# EAGLE design combo-03 (EAGLE 7.7.0)
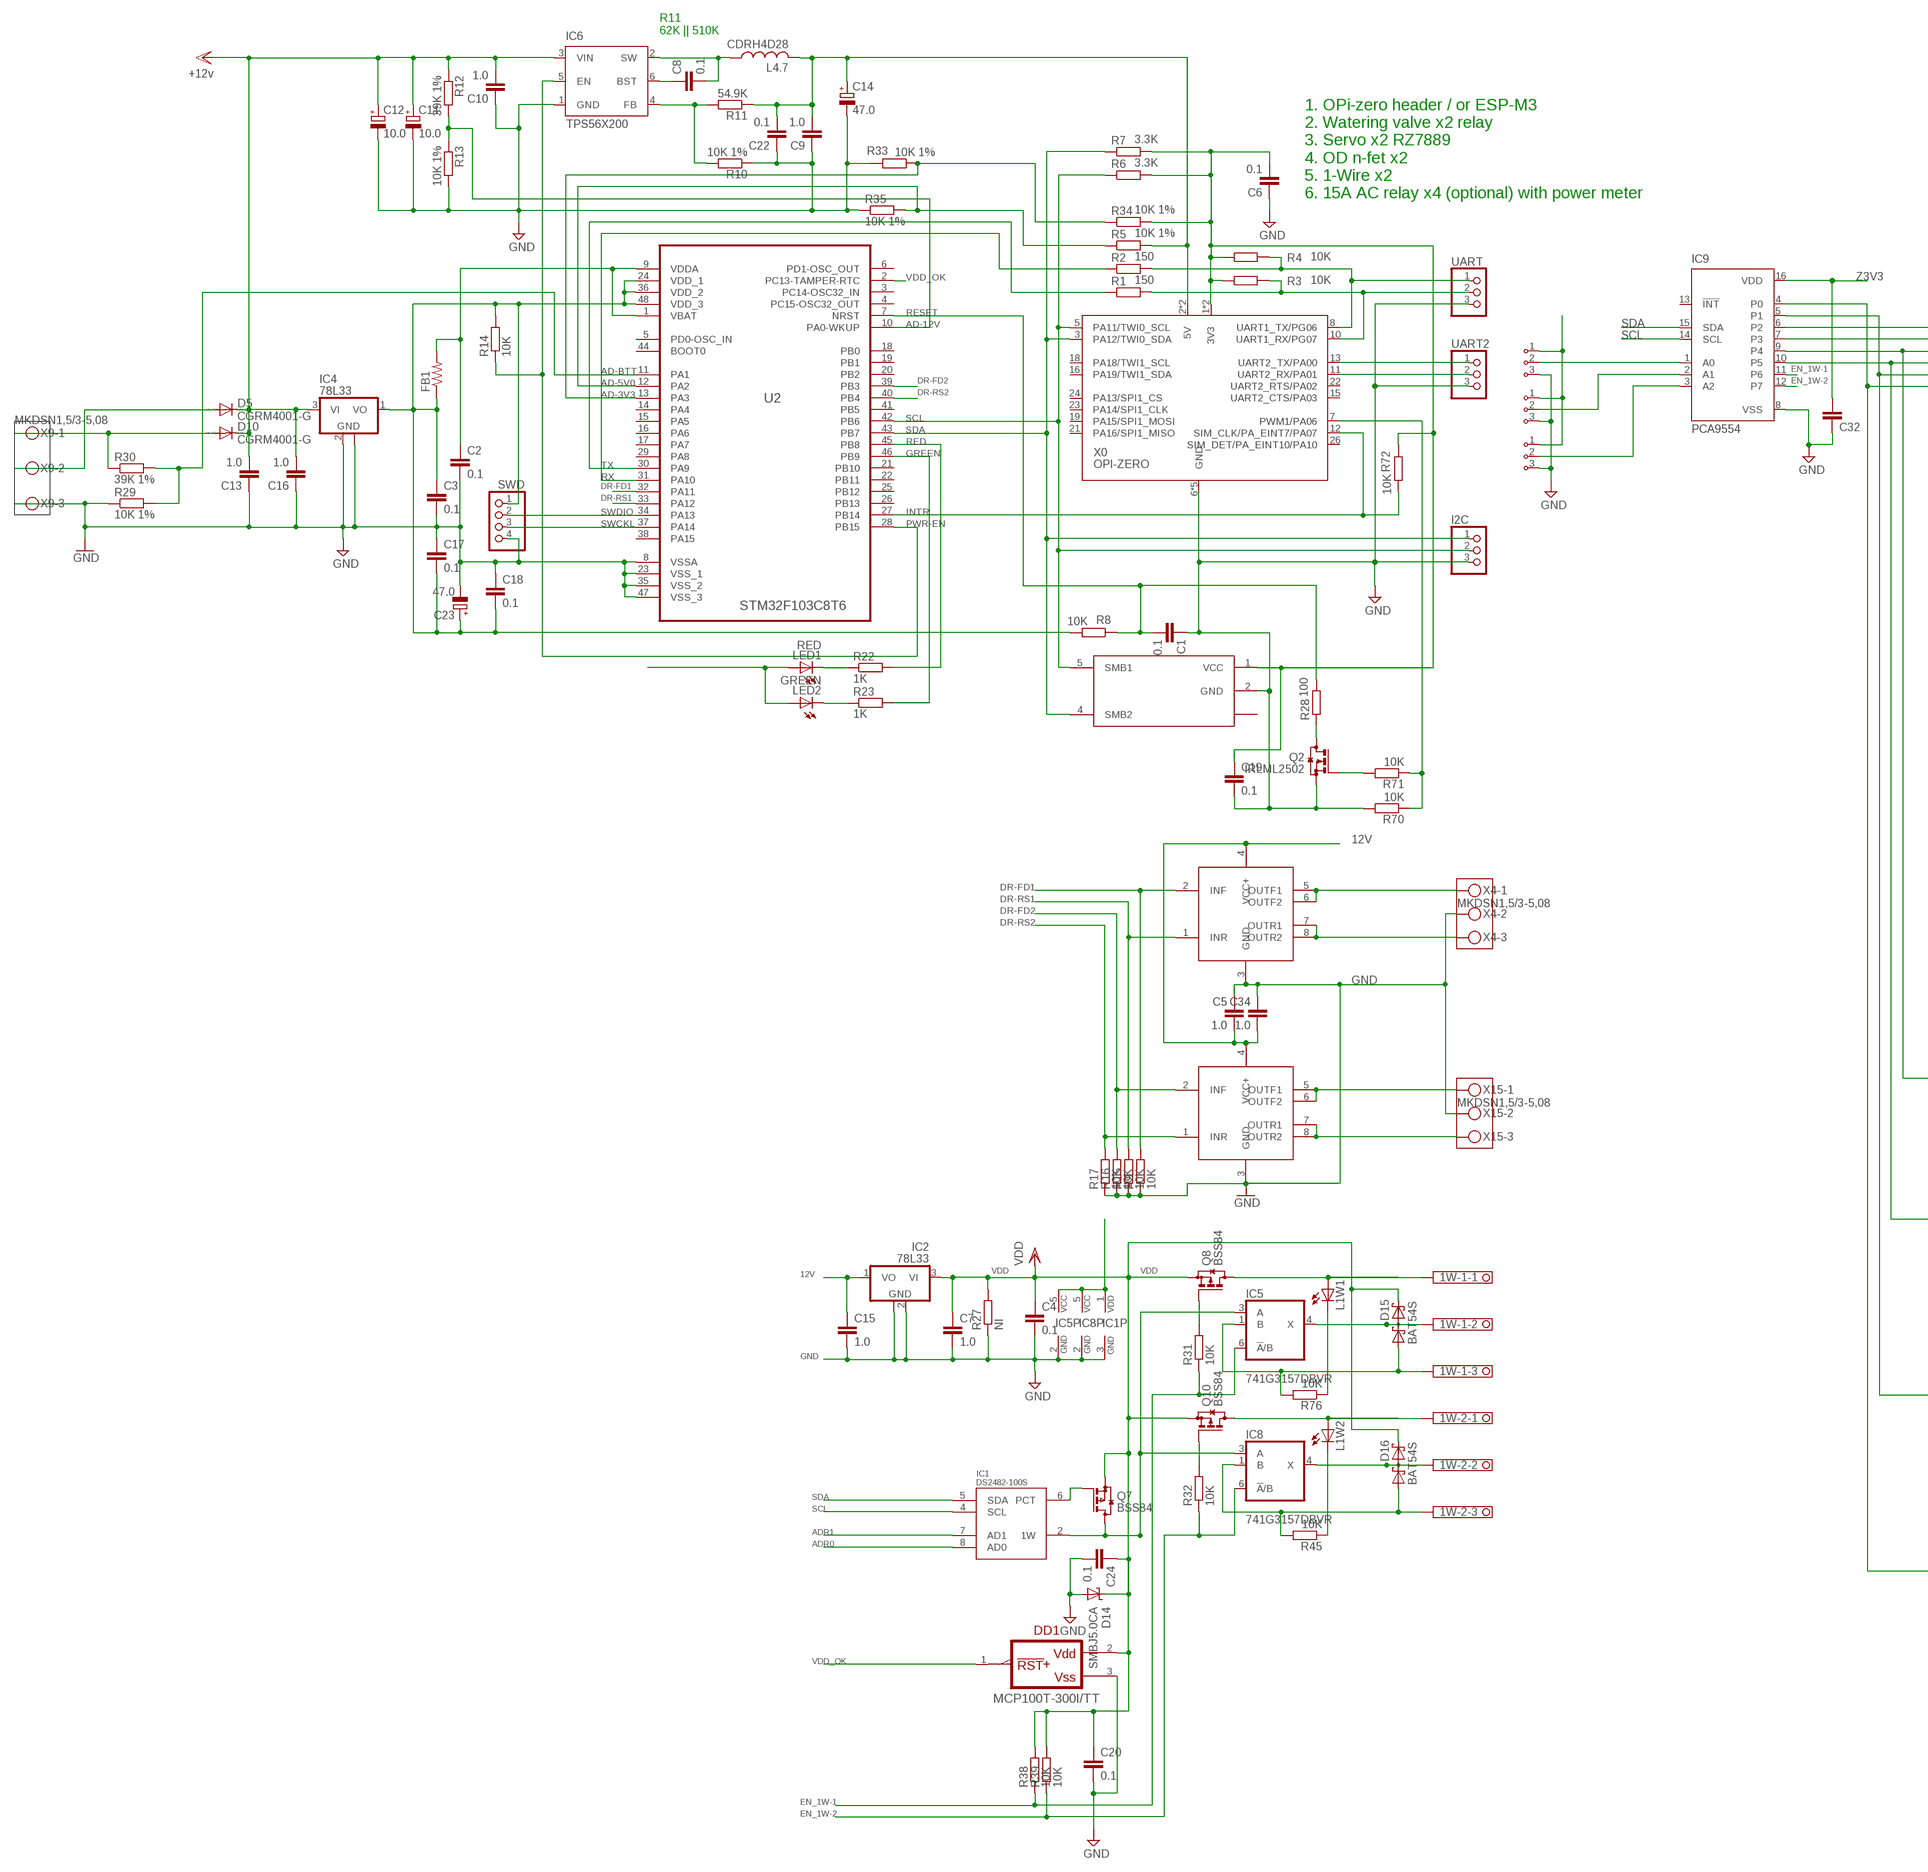
[diagram p0: schematic, sheet 1, part 1 of 2]
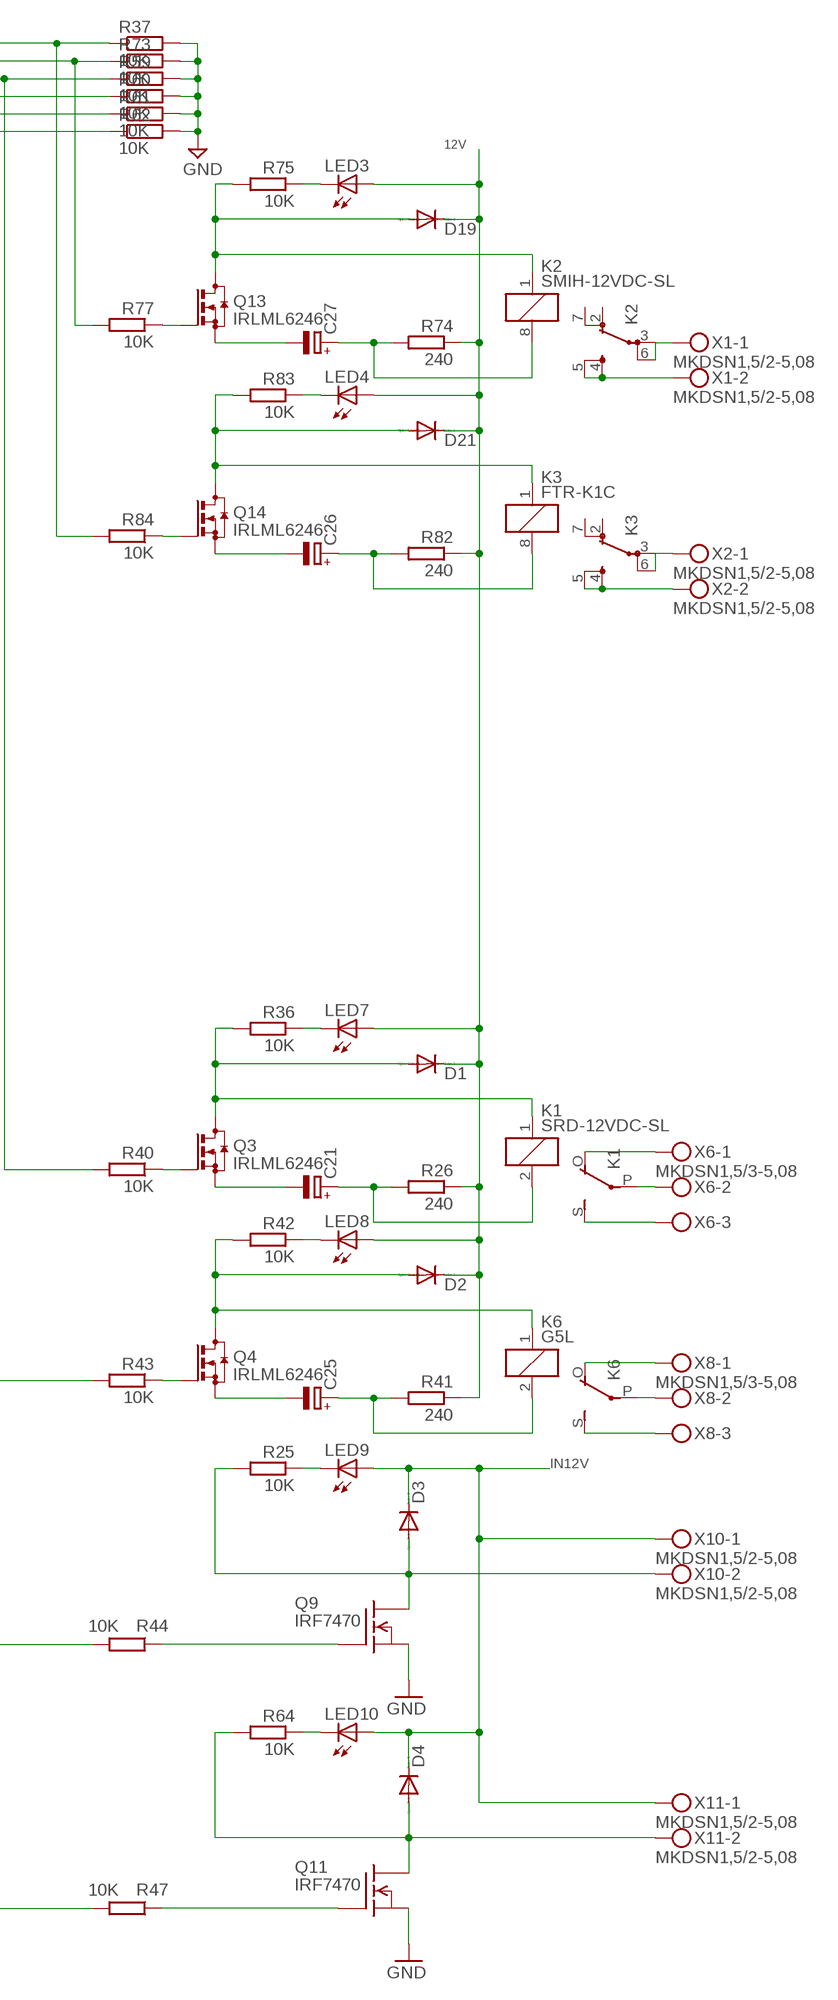
[diagram p1: schematic, sheet 1, part 2 of 2]

## Parts
1W-1  1751251  [1751251]
1W-2  1751251  [1751251]
A0  ADDR3PIN0603  [0603-3PIN]
A1  ADDR3PIN0603  [0603-3PIN]
A2  ADDR3PIN0603  [0603-3PIN]
C1  0.1  C-EUC0603  [C0603]
C2  0.1  C-EUC0603  [C0603]
C3  0.1  C-EUC0603  [C0603]
C4  0.1  C-EUC0603  [C0603]
C5  1.0  C-EUC0805  [C0805]
C6  0.1  C-EUC0805  [C0805]
C7  1.0  C-EUC0805  [C0805]
C8  0.1  C-EUC0805  [C0805]
C9  1.0  C-EUC0805  [C0805]
C10  1.0  C-EUC1206  [C1206]
C11  10.0  CPOL-EUC/6032-28R  [C/6032-28R]
C12  10.0  CPOL-EUC/6032-28R  [C/6032-28R]
C13  1.0  C-EUC1206  [C1206]
C14  47.0  CPOL-EUB/3528-21R  [B/3528-21R]
C15  1.0  C-EUC0805  [C0805]
C16  1.0  C-EUC1206  [C1206]
C17  0.1  C-EUC0603  [C0603]
C18  0.1  C-EUC0603  [C0603]
C19  0.1  C-EUC0603  [C0603]
C20  0.1  C-EUC0603  [C0603]
C21  CPOL-EUE3.5-8  [E3,5-8]
C22  0.1  C-EUC0805  [C0805]
C23  47.0  CPOL-EUB/3528-21R  [B/3528-21R]
C24  0.1  C-EUC0603  [C0603]
C25  CPOL-EUE3.5-8  [E3,5-8]
C26  CPOL-EUE3.5-8  [E3,5-8]
C27  CPOL-EUE3.5-8  [E3,5-8]
C32  C-EUC0805  [C0805]
C34  1.0  C-EUC0805  [C0805]
D1  DIODE-SOD123  [SOD123]
D2  DIODE-SOD123  [SOD123]
D3  DIODE-SOD123  [SOD123]
D4  DIODE-SOD123  [SOD123]
D5  CGRM4001-G  [SOD-123_MINI-SMA]
D10  CGRM4001-G  [SOD-123_MINI-SMA]
D14  SMBJ5.0CA  SUPPRESSOR-SMBJ  [SMBJ]
D15  BAT54S  [SOT23]
D16  BAT54S  [SOT23]
D19  DIODE-SOD123  [SOD123]
D21  DIODE-SOD123  [SOD123]
DD1  MCP100T-300I/TT  [SOT23]
FB1  R-US_R0805  [R0805]
I2C  PINHD-1X3  [1X03]
IC1  DS2482-100S  [SO08]
IC2  78L33  78L05F  [SOT89]
IC3  RZ7889  [SO8]
IC4  78L33  78L05F  [SOT89]
IC5  741G3157DBVR  [DBV_R-PDSO-G6]
IC6  TPS56X200  [TSOT23-6_DDC]
IC7  LTC1694  [SOT23-5]
IC8  741G3157DBVR  [DBV_R-PDSO-G6]
IC9  PCA9554  PCF8574T  [SO16W]
IC10  RZ7889  [SO8]
K1  SRD-12VDC-SL  G5L  [G5LE]
K2  SMIH-12VDC-SL  FTR-K1C  [FTR-K1C]
K3  FTR-K1C  [FTR-K1C]
K6  G5L  [G5LE]
L1W1  LEDSMT1206  [1206]
L1W2  LEDSMT1206  [1206]
L4.7  CDRH4D28  [CDRH4D28]
LED1  RED  LEDCHIPLED_1206  [CHIPLED_1206]
LED2  GREEN  LEDCHIPLED_1206  [CHIPLED_1206]
LED3  LEDSMT1206  [1206]
LED4  LEDSMT1206  [1206]
LED7  LEDSMT1206  [1206]
LED8  LEDSMT1206  [1206]
LED9  LEDSMT1206  [1206]
LED10  LEDSMT1206  [1206]
Q2  IRLML2502  [SOT23]
Q3  IRLML6246  BSS123  [SOT23]
Q4  IRLML6246  BSS123  [SOT23]
Q7  BSS84  [SOT23]
Q8  BSS84  [SOT23]
Q9  IRF7470  FDS5680  [SO-8]
Q10  BSS84  [SOT23]
Q11  IRF7470  FDS5680  [SO-8]
Q13  IRLML6246  BSS123  [SOT23]
Q14  IRLML6246  BSS123  [SOT23]
R1  150  R-EU_R0603  [R0603]
R2  150  R-EU_R0603  [R0603]
R3  10K  R-EU_R0603  [R0603]
R4  10K  R-EU_R0603  [R0603]
R5  10K 1%  R-EU_R0603  [R0603]
R6  3.3K  R-EU_R0603  [R0603]
R7  3.3K  R-EU_R0603  [R0603]
R8  10K  R-EU_R0603  [R0603]
R9  10K  R-EU_R0603  [R0603]
R10  10K 1%  R-EU_R0603  [R0603]
R11  54.9K  R-EU_R0603  [R0603]
R12  39K 1%  R-EU_R0603  [R0603]
R13  10K 1%  R-EU_R0603  [R0603]
R14  10K  R-EU_R0603  [R0603]
R15  10K  R-EU_R0603  [R0603]
R16  10K  R-EU_R0603  [R0603]
R17  10K  R-EU_R0603  [R0603]
R22  1K  R-EU_R0603  [R0603]
R23  1K  R-EU_R0603  [R0603]
R25  10K  R-EU_R0603  [R0603]
R26  240  R-EU_R1206  [R1206]
R27  NI  R-EU_R0603  [R0603]
R28  100  R-EU_R0603  [R0603]
R29  10K 1%  R-EU_R0603  [R0603]
R30  39K 1%  R-EU_R0603  [R0603]
R31  10K  R-EU_R0603  [R0603]
R32  10K  R-EU_R0603  [R0603]
R33  10K 1%  R-EU_R0603  [R0603]
R34  10K 1%  R-EU_R0603  [R0603]
R35  10K 1%  R-EU_R0603  [R0603]
R36  10K  R-EU_R0603  [R0603]
R37  10K  R-EU_R0603  [R0603]
R38  10K  R-EU_R0603  [R0603]
R39  10K  R-EU_R0603  [R0603]
R40  10K  R-EU_R0603  [R0603]
R41  240  R-EU_R1206  [R1206]
R42  10K  R-EU_R0603  [R0603]
R43  10K  R-EU_R0603  [R0603]
R44  10K  R-EU_R0603  [R0603]
R45  10K  R-EU_R0603  [R0603]
R47  10K  R-EU_R0603  [R0603]
R59  10K  R-EU_R0603  [R0603]
R60  10K  R-EU_R0603  [R0603]
R61  10K  R-EU_R0603  [R0603]
R62  10K  R-EU_R0603  [R0603]
R64  10K  R-EU_R0603  [R0603]
R70  10K  R-EU_R0603  [R0603]
R71  10K  R-EU_R0603  [R0603]
R72  10K  R-EU_R0603  [R0603]
R73  10K  R-EU_R0603  [R0603]
R74  240  R-EU_R1206  [R1206]
R75  10K  R-EU_R0603  [R0603]
R76  10K  R-EU_R0603  [R0603]
R77  10K  R-EU_R0603  [R0603]
R82  240  R-EU_R1206  [R1206]
R83  10K  R-EU_R0603  [R0603]
R84  10K  R-EU_R0603  [R0603]
SWD  PINHD-1X4  [1X04]
U2  STM32F103C8T6  STM32F100CBT6B  [QFP50P900X900X160-48N]
UART  PINHD-1X3  [1X03]
UART2  PINHD-1X3  [1X03]
X0  OPI-ZERO  [OPI0]
X1  MKDSN1,5/2-5,08  [MKDSN1,5/2-5,08]
X2  MKDSN1,5/2-5,08  [MKDSN1,5/2-5,08]
X4  MKDSN1,5/3-5,08  [MKDSN1,5/3-5,08]
X6  MKDSN1,5/3-5,08  [MKDSN1,5/3-5,08]
X8  MKDSN1,5/3-5,08  [MKDSN1,5/3-5,08]
X9  MKDSN1,5/3-5,08  [MKDSN1,5/3-5,08]
X10  MKDSN1,5/2-5,08  [MKDSN1,5/2-5,08]
X11  MKDSN1,5/2-5,08  [MKDSN1,5/2-5,08]
X15  MKDSN1,5/3-5,08  [MKDSN1,5/3-5,08]

## Nets
1W: IC1.2(1W) IC5.3(A) IC8.3(A) Q7.3(D)
1W1-VDD: 1W-1.1 L1W1.A Q8.3(D)
1W2-VDD: 1W-2.1 L1W2.A Q10.3(D)
12V [POWER]: C5.2 C10.2 C11.+ C12.+ C13.2 C15.1 C16.2 C34.2 D1.C D2.C D5.C D10.C D19.C D21.C IC2.1(VO) IC3.4(VCC+) IC4.3(VI) IC6.3(VIN) IC10.4(VCC+) LED3.A LED4.A LED7.A LED8.A R12.1 R26.1 R41.1 R74.1 R82.1 ; supply symbol labelled +12v
+3V3 [POWER]: C3.1 C17.2 C18.2 C23.+ FB1.1 IC4.1(VO) R8.2 R14.2 SWD.1 U2.24(VDD_1) U2.36(VDD_2) U2.48(VDD_3)
AD-3V3: R33.1 R34.1 U2.13(PA3)
AD-5V0: R5.1 R35.2 U2.12(PA2)
AD-12V: R12.2 R13.1 U2.10(PA0-WKUP)
AD-BTT: R29.2 R30.2 U2.11(PA1)
ADR0: A2.2 IC1.8(AD0) IC9.1(A0)
ADR1: A1.2 IC1.7(AD1) IC9.2(A1)
ADR2: A0.2 IC9.3(A2)
BAT+: D10.A R30.1 X9.1
DR-FD1: IC3.2(INF) R9.2 U2.32(PA11)
DR-FD2: IC10.2(INF) R16.2 U2.39(PB3)
DR-RS1: IC3.1(INR) R15.2 U2.33(PA12)
DR-RS2: IC10.1(INR) R17.2 U2.40(PB4)
EN_1W-1: IC5.6(!A!/B) IC9.11(P6) R31.1 R38.1
EN_1W-2: IC8.6(!A!/B) IC9.12(P7) R32.1 R39.1
FET: D3.A Q9.5(D) Q9.6(D) Q9.7(D) Q9.8(D) R25.2 X10.2
FET1: D4.A Q11.5(D) Q11.6(D) Q11.7(D) Q11.8(D) R64.2 X11.2
FR1: IC3.5(OUTF1) IC3.6(OUTF2) X4.1
FR2: IC10.5(OUTF1) IC10.6(OUTF2) X15.1
GND [POWER]: 1W-1.3 1W-2.3 A0.3 A1.3 A2.3 C1.1 C2.2 C3.2 C4.2 C5.1 C6.1 C7.2 C9.1 C10.1 C11.- C12.- C13.1 C14.- C15.2 C16.1 C17.1 C18.1 C19.2 C20.2 C21.- C22.1 C23.- C24.2 C25.- C26.- C27.- C32.1 C34.1 D14.A D15.1(A1) D16.1(A1) DD1.3(VSS) I2C.3 IC1.3(GND) IC2.2(GND) IC2.2@1(GND) IC3.3(GND) IC4.2(GND) IC4.2@1(GND) IC5.1(B) IC5.2(GND) IC6.1(GND) IC7.2(GND) IC8.1(B) IC8.2(GND) IC9.8(VSS) IC10.3(GND) Q2.2(S) Q3.2(S) Q4.2(S) Q9.1(S) Q9.2(S) Q9.3(S) Q11.1(S) Q11.2(S) Q11.3(S) Q13.2(S) Q14.2(S) R9.1 R10.1 R13.2 R15.1 R16.1 R17.1 R27.1 R29.1 R33.2 R35.1 R37.2 R45.2 R59.2 R60.2 R61.2 R62.2 R70.2 R73.2 R76.2 SWD.4 U2.8(VSSA) U2.23(VSS_1) U2.35(VSS_2) U2.47(VSS_3) UART2.3 UART.3 X0.6(GND) X0.9(GND) X0.14(GND) X0.20(GND) X0.25(GND) X4.2 X9.3 X15.2
GPIO1: IC9.9(P4) R40.2 R59.1
GPIO2: IC9.10(P5) R43.2 R60.1
GPIO4: IC9.7(P3) R73.1 R77.2
GREEN: R23.2 U2.46(PB9)
IN12V [POWER]: D3.C D4.C D5.A LED9.A LED10.A X9.2 X10.1 X11.1
INTR: R72.2 U2.27(PB14) X0.12(SIM_CLK/PA_EINT7/PA07)
IO13: IC9.5(P1) R44.2 R61.1
N$2: K3.4(-1:SA) K3.5(-1:SB) X2.2
N$3 [POWER]: C8.2 IC6.2(SW) L4.7.P$1
N$4: Q2.3(D) R28.1
N$5: Q2.1(G) R71.2
N$9: IC9.6(P2) R37.1 R84.2
N$10: Q9.4(G) R44.1
N$11: IC1.6(PCT) Q7.1(G)
N$13: Q14.1(G) R84.1
N$15: D1.A K1.1 Q3.3(D) R36.2
N$16: C21.+ K1.2 R26.2
N$17: C8.1 IC6.6(BST)
N$18: LED7.C R36.1
N$19: Q3.1(G) R40.1
N$20: D2.A K6.1 Q4.3(D) R42.2
N$21: C25.+ K6.2 R41.2
N$22: IC6.4(FB) R10.2 R11.2
N$23: LED8.C R42.1
N$24: Q4.1(G) R43.1
N$27: 1W-1.2 D15.3(C1A2) IC5.4(X)
N$37: Q8.1(G) R31.2
N$39: IC9.4(P0) R47.2 R62.1
N$40: K3.3(-1:PA) K3.6(-1:PB) X2.1
N$41: 1W-2.2 D16.3(C1A2) IC8.4(X)
N$45: Q10.1(G) R32.2
N$47: K1.P(2:P) X6.2
N$51: K6.P(2:P) X8.2
N$55: D19.A K2.1 Q13.3(D) R75.2
N$60: C27.+ K2.8 R74.2
N$62: LED3.C R75.1
N$69: Q11.4(G) R47.1
N$70: LED10.C R64.1
N$71: LED9.C R25.1
N$75: LED1.C R22.1
N$111: D21.A K3.1 Q14.3(D) R83.2
N$112: Q13.1(G) R77.1
N$115: L1W2.C R45.1
N$116: L1W1.C R76.1
N$117: C26.+ K3.8 R82.2
N$118: LED4.C R83.1
N$119: LED2.C R23.1
N$128: K2.3(-1:PA) K2.6(-1:PB) X1.1
N$129: K2.4(-1:SA) K2.5(-1:SB) X1.2
NC1: K1.O(2:O) X6.1
NC6: K6.O(2:O) X8.1
NO1: K1.S(2:S) X6.3
NO6: K6.S(2:S) X8.3
PA06: R70.1 R71.1 X0.7(PWM1/PA06)
PWR-EN: IC6.5(EN) R14.1 U2.28(PB15)
RED: R22.2 U2.45(PB8)
RESET: C1.2 R8.1 R28.2 U2.7(NRST)
RS1: IC3.7(OUTR1) IC3.8(OUTR2) X4.3
RS2: IC10.7(OUTR1) IC10.8(OUTR2) X15.3
RX: R2.1 U2.31(PA10)
SCL: I2C.2 IC1.4(SCL) IC7.5(SMB1) IC9.14(SCL) R6.1 U2.42(PB6) X0.5(PA11/TWI0_SCL)
SDA: I2C.1 IC1.5(SDA) IC7.4(SMB2) IC9.15(SDA) R7.1 U2.43(PB7) X0.3(PA12/TWI0_SDA)
SWCKL: SWD.3 U2.37(PA14)
SWDIO: SWD.2 U2.34(PA13)
TX: R1.1 U2.30(PA9)
VDD [POWER]: C4.1 C7.1 C20.1 C24.1 D14.C D15.2(C2) D16.2(C2) DD1.2(VDD) IC2.3(VI) LED1.A LED2.A Q7.2(S) Q8.2(S) Q10.2(S) R27.2 R38.2 R39.2
VDD_OK: DD1.1(!RST) U2.2(PC13-TAMPER-RTC)
VDDA: C2.1 FB1.2 U2.1(VBAT) U2.9(VDDA)
Z2RX: UART2.2 X0.11(UART2_RX/PA01)
Z2TX: UART2.1 X0.13(UART2_TX/PA00)
Z3V3 [POWER]: A0.1 A1.1 A2.1 C6.2 C19.1 C32.2 IC1.1(VDD) IC5.5(VCC) IC7.1(VCC) IC8.5(VCC) IC9.16(VDD) R3.1 R4.1 R6.2 R7.2 R34.2 R72.1 X0.1(3V3) X0.17(3V3)
Z5V [POWER]: C9.2 C14.+ C22.2 L4.7.P$2 R5.2 R11.1 X0.2(5V) X0.4(5V)
ZRX: R1.2 R3.2 UART.2 X0.10(UART1_RX/PG07)
ZTX: R2.2 R4.2 UART.1 X0.8(UART1_TX/PG06)
Unconnected: IC7.3(NC) IC9.13(!INT) K2.2(-1:OA) K2.7(-1:OB) K3.2(-1:OA) K3.7(-1:OB) U2.3(PC14-OSC32_IN) U2.4(PC15-OSC32_OUT) U2.5(PD0-OSC_IN) U2.6(PD1-OSC_OUT) U2.14(PA4) U2.15(PA5) U2.16(PA6) U2.17(PA7) U2.18(PB0) U2.19(PB1) U2.20(PB2) U2.21(PB10) U2.22(PB11) U2.25(PB12) U2.26(PB13) U2.29(PA8) U2.38(PA15) U2.41(PB5) U2.44(BOOT0) X0.15(UART2_CTS/PA03) X0.16(PA19/TWI1_SDA) X0.18(PA18/TWI1_SCL) X0.19(PA15/SPI1_MOSI) X0.21(PA16/SPI1_MISO) X0.22(UART2_RTS/PA02) X0.23(PA14/SPI1_CLK) X0.24(PA13/SPI1_CS) X0.26(SIM_DET/PA_EINT10/PA10)

## Notes on the sheet
- R11
  62K || 510K
- 1. OPi-zero header / or ESP-M3 
  2. Watering valve x2 relay
  3. Servo x2 RZ7889
  4. OD n-fet x2
  5. 1-Wire x2
  6. 15A AC relay x4 (optional) with power meter

## Library data of the parts
1W-1 1W-2 = con-phoenix-350:1751251: MKDS 1/ 3-3,5 Printklemme Nennstrom: 10 A Bemessungsspannung: 160 V Raster: 3,5 mm Polzahl: 3 Montageart: Löten Anschlussart: Schraubanschluss Anschlussrichtung vom Leiter zur Platine: 0° Source: http://eshop.phoenixcontact.com .. 1751251.pdf; OC_FARNELL: unknown; OC_NEWARK: unknown
A0 A1 A2 = components:ADDR3PIN
C1-C10 C13 C15-C20 C22 C24 C32 C34 = rcl:C-EU: CAPACITOR, European symbol
C11 C12 C14 C21 C23 C25-C27 = rcl:CPOL-EU: POLARIZED CAPACITOR, European symbol
D1-D4 D19 D21 = diode:DIODE-: DIODE
D5 D10 = diode:CGRM400*-G: Molded plasitc,JEDEC SOD-123/Mini SMA Source: Comchip CGRM4001-G.pdf
D14 = diode:SUPPRESSOR-: Suppressor diode
D15 D16 = diode:BAT54S: Schottky Diodes Pin connection corrected 2011-05-04 Source: Fairchild .. BAT54.pdf
DD1 = ic-microchip:MCP100; MOUSER: 579-MCP100T-300I/TT
FB1 = rcl:R-US_: RESISTOR, American symbol
I2C UART UART2 = pinhead:PINHD-1X3: PIN HEADER
IC1 = 1wire:DS2482-100: I2C to 1-Wire Host Adapter/Line Driver This device is a onewire host and I2C interface in one chip. It provides the complete DC/AC requirements for onewire communication, including overdrive speed mode, but, unlike the DS2480B chip, no 12V EPROM programming. Notes: For overdrive speed and 5V EEPROM programming, an external active pullup circuit must be connected to the 1W, VDD and PCT pin. See the datasheet for details. The lower two I2C adress bits of the chip can be selected by external pins, so up to 4 chips may be connected to the same I2C bus. Author: Orginal device and description from Giovanni Varasano <giovanni.varasano@fastwebnet.it> Improved by Jan Kandziora <jjj@gmx.de>
IC2 IC4 = linear:78L*: POSITOIV-VOLTAGE REGULATORS Output up to 100 mA Source: Datasheet <http://focus.ti.com/lit/ds/symlink/ua78l05.pdf>
IC3 IC10 = components:RZ788
IC5 IC8 = 74xx-little-de:74*1G3157: Single-Pole, Double-Throw Analog Switch Source: http://focus.ti.com/lit/ds/symlink/sn74lvc1g3157.pdf
IC6 = custom:TPS56X200
IC7 = components:LTC1694: Dual SMBus active pull-up
IC9 = micro-philips:PCF8574: I2C-Bus Remote 8-bit I/O expander http://www.semiconductors.philips.com/acrobat_download/datasheets/PCF8574_4.pdf; MPN: PCF8574T/3,512; OC_FARNELL: 1201255; OC_NEWARK: 70R6870
K1 K6 = relay:G5L: RELAY 1 x switch, 10 A/120 V AC, 8 A/30 V ADC, Omron; OC_FARNELL: unknown; OC_NEWARK: unknown
K2 K3 = relay:FTR-K1C: NETZRELAIS FTR-K1CK024W1XUM 16A/250VAC 1 Umschaltkontakt Distributor: Conrad Electronic Bestell Nr.: 504389-13 - 24V Source: http://www.produktinfo.conrad.com/datenblaetter/500000-524999/504384-da-01-de-NETZRELAIS_FTR_K1CK012W1XUM_16A_250VAC.pdf; OC_FARNELL: unknown; OC_NEWARK: unknown
L1W1 L1W2 LED1-LED4 LED7-LED10 = led:LED: LED OSRAM: - CHIPLED LG R971, LG N971, LY N971, LG Q971, LY Q971, LO R971, LY R971 LH N974, LH R974 LS Q976, LO Q976, LY Q976 LO Q996 - Hyper CHIPLED LW Q18S LB Q993, LB Q99A, LB R99A - SideLED LS A670, LO A670, LY A670, LG A670, LP A670 LB A673, LV A673, LT A673, LW A673 LH A674 LY A675 LS A676, LA A676, LO A676, LY A676, LW A676 LS A679, LY A679, LG A679 - Hyper Micro SIDELED® LS Y876, LA Y876, LO Y876, LY Y876 LT Y87S - SmartLED LW L88C, LW L88S LB L89C, LB L89S, LG L890 LS L89K, LO L89K, LY L89K LS L896, LA L896, LO L896, LY L896 - TOPLED LS T670, LO T670, LY T670, LG T670, LP T670 LSG T670, LSP T670, LSY T670, LOP T670, LYG T670 LG T671, LOG T671, LSG T671 LB T673, LV T673, LT T673, LW T673 LH T674 LS T676, LA T676, LO T676, LY T676, LB T676, LH T676, LSB T676, LW T676 LB T67C, LV T67C, LT T67C, LS T67K, LO T67K, LY T67K, LW E67C LS E67B, LA E67B, LO E67B, LY E67B, LB E67C, LV E67C, LT E67C LW T67C LS T679, LY T679, LG T679 LS T770, LO T770, LY T770, LG T770, LP T770 LB T773, LV T773, LT T773, LW T773 LH T774 LS E675, LA E675, LY E675, LS T675 LS T776, LA T776, LO T776, LY T776, LB T776 LHGB T686 LT T68C, LB T68C - Hyper Mini TOPLED® LB M676 - Mini TOPLED Santana® LG M470 LS M47K, LO M47K, LY M47K Source: http://www.osram.convergy.de LUXEON: - LUMILED® LXK2-PW12-R00, LXK2-PW12-S00, LXK2-PW14-U00, LXK2-PW14-V00 LXK2-PM12-R00, LXK2-PM12-S00, LXK2-PM14-U00 LXK2-PE12-Q00, LXK2-PE12-R00, LXK2-PE12-S00, LXK2-PE14-T00, LXK2-PE14-U00 LXK2-PB12-K00, LXK2-PB12-L00, LXK2-PB12-M00, LXK2-PB14-N00, LXK2-PB14-P00, LXK2-PB14-Q00 LXK2-PR12-L00, LXK2-PR12-M00, LXK2-PR14-Q00, LXK2-PR14-R00 LXK2-PD12-Q00, LXK2-PD12-R00, LXK2-PD12-S00 LXK2-PH12-R00, LXK2-PH12-S00 LXK2-PL12-P00, LXK2-PL12-Q00, LXK2-PL12-R00 Source: www.luxeon.com KINGBRIGHT: KA-3528ASYC Source: www.kingbright.com
L4.7 = custom:CDRH4D28
Q2 = components:IRLML2502: N-CHANNEL MOS FET
Q3 Q4 Q13 Q14 = transistor-small-signal:BSS123: N-CHANNEL MOS FET
Q7 Q8 Q10 = transistor-small-signal:BSS84: P-CHANNEL MOS FET
Q9 Q11 = transistor-fet:FDS5680: 60V N-Channel PowerTrench TM MOSFET FAIRCHILD FDS5680.pdf
R1-R17 R22 R23 R25-R45 R47 R59-R62 R64 R70-R77 R82-R84 = rcl:R-EU_: RESISTOR, European symbol
SWD = pinhead:PINHD-1X4: PIN HEADER
U2 = ST Microelctronics_By_element14_Batch_1:STM32F100CBT6B: ARM-based 32-bit MCU; MPN: STM32F100CBT6B; OC_FARNELL: 1838512; OC_NEWARK: 86R1308; PACKAGE: LQFP-48; SUPPLIER: STMircroelectronics
X0 = OrangePi0:OPI-ZERO: Orange Pi Zero Footprint. Only 2x13 pin header. -- UNTESTED!
X1 X2 X10 X11 = con-phoenix-508:MKDSN1,5/2-5,08: MKDSN 1,5/ 2-5,08 Printklemme Nennstrom: 13,5 A Nennspannung: 250 V Rastermaß: 5,08 mm Polzahl: 2 Anschlussart: Schraubanschluss Montage: Löten Anschlussrichtung Leiter/Platine: 0 ° Artikelnummer: 1729128 Source: http://eshop.phoenixcontact.com .. 1729128.pdf
X4 X6 X8 X9 X15 = con-phoenix-508:MKDSN1,5/3-5,08: MKDSN 1,5/ 3-5,08 Printklemme Nennstrom: 13,5 A Nennspannung: 250 V Rastermaß: 5,08 mm Polzahl: 3 Anschlussart: Schraubanschluss Montage: Löten Anschlussrichtung Leiter/Platine: 0 ° Artikelnummer: 1729131 Source: http://eshop.phoenixcontact.com .. 1729131.pdf

## Net classes
0 default: width 0.254 mm, clearance 0.254 mm
1 POWER: width 0.508 mm, clearance 0.254 mm
2 HV: width 1.27 mm, clearance 1.27 mm

## Board
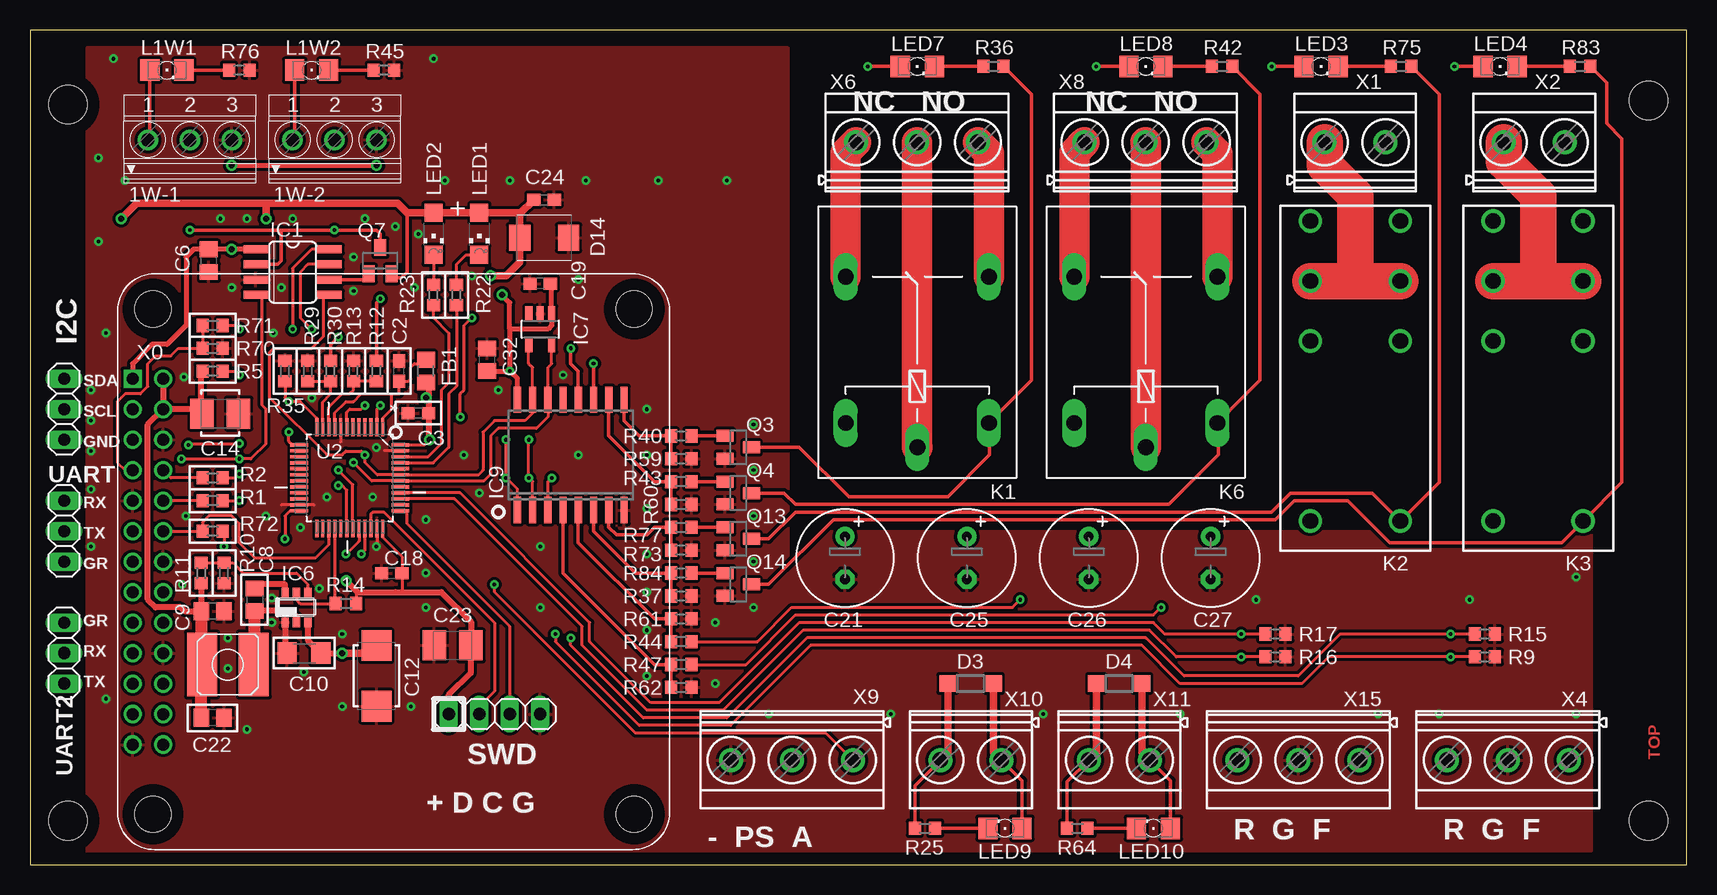
[diagram p2: board, top side]
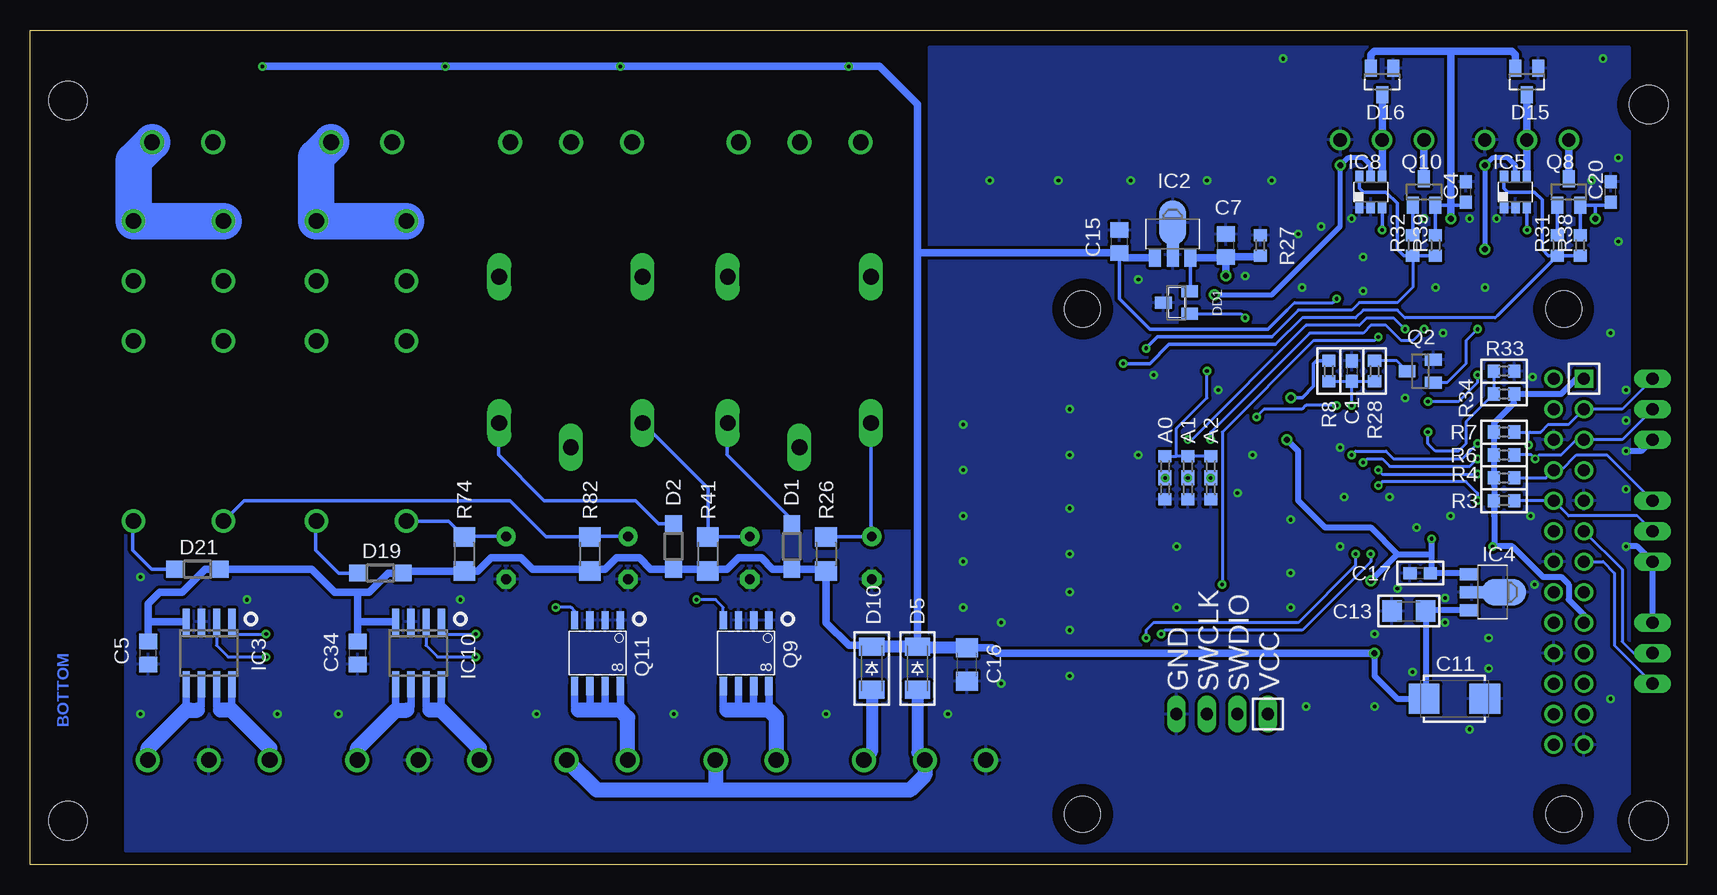
[diagram p3: board, bottom side, seen from below]

Size 138.1 x 69.58 mm. Coordinates in mm from the lower left corner, seen from the top.
Outline: 138.1,0 138.1,69.58 0,69.58 0,0 138.1,0
Copper layers (1*16): Top 0.035mm / dielectric 1.5mm / Bottom 0.035mm
Design rules "default *": minimum track width 8mil, minimum drill 0.3mm, track to track 4mil, track to pad 4mil, pad to pad 4mil, via to via 8mil, smd to smd 4mil, copper to edge 40mil, drill to drill 10mil, minimum pad ring 10mil, minimum via ring 8mil, stop-mask expansion 4mil, vias tented up to drill 20mil, thermal gap 10mil
Holes 3.2 mm at 3.16,63.37 134.93,63.69 134.93,3.68 3.16,3.68

### Footprints (pad centres in the part's own frame; a part is rotated, then mirrored left to right if it is on the bottom)
1751251 = drill 1.1 pad 1.7: 1 -3.5,-0.1; 2 0,-0.1; 3 3.5,-0.1
0603-3PIN = smd 1 x 1.1: 1 -0.85,1.27; 3 2.755,1.27 | smd 1.227 x 1.1: 2 0.954,1.27
C0603 = smd 1.1 x 1: 1 -0.85,0; 2 0.85,0
C0805 = smd 1.3 x 1.5: 1 -0.95,0; 2 0.95,0
C1206 = smd 1.6 x 1.8: 1 -1.4,0; 2 1.4,0
C/6032-28R = smd 2.55 x 2.5: + 2.525,0; - -2.525,0
B/3528-21R = smd 1.95 x 2.5: + 1.525,0; - -1.525,0
E3,5-8 = drill 0.813 pad 1.6: + -1.778,0 | drill 0.813 pad 1.6 octagon: - 1.778,0
SOD123 = smd 1.4 x 1.4: A 1.9,0; C -1.9,0
SOD-123_MINI-SMA = smd 1.5 x 2.1: A 1.8,0; C -1.8,0
SMBJ = smd 1.78 x 2.16: A 2.04,0; C -2.03,0
SOT23 = smd 1 x 1.4: 1 -0.95,-1.1; 2 0.95,-1.1; 3 0,1.1
R0805 = smd 1.3 x 1.5: 1 -0.95,0; 2 0.95,0
1X03 = drill 1.016 long: 1 -2.54,0; 2 0,0; 3 2.54,0
SO08 = smd 0.66 x 2.032: 1 -1.905,-3.073; 2 -0.635,-3.073; 3 0.635,-3.073; 4 1.905,-3.073; 5 1.905,3.073; 6 0.635,3.073; 7 -0.635,3.073; 8 -1.905,3.073
SOT89 = smd 1 x 1.5: 1 -1.499,-1.981; 3 1.499,-1.981 | smd 1 x 2: 2 0,-1.727 | smd 2.2 x 3.7: 2@1 0,0.94
SO8 = smd 0.6 x 2.2: 1 -1.905,-2.6; 2 -0.635,-2.6; 3 0.635,-2.6; 4 1.905,-2.6; 5 1.905,2.6; 6 0.635,2.6; 7 -0.635,2.6; 8 -1.905,2.6
DBV_R-PDSO-G6 = smd 0.69 x 0.99: 1 -0.95,-1.29; 2 0,-1.29; 3 0.95,-1.29; 4 0.95,1.3; 5 0,1.3; 6 -0.95,1.3
TSOT23-6_DDC = smd 0.6 x 0.8: 1 -0.95,-1.25; 2 0,-1.25; 3 0.95,-1.25; 4 0.95,1.25; 5 0,1.25; 6 -0.95,1.25
SOT23-5 = smd 0.6 x 1.2: 1 -0.95,-1.306; 2 0,-1.306; 3 0.95,-1.306; 4 0.95,1.306; 5 -0.95,1.306
SO16W = smd 0.6 x 2.2: 1 -4.445,-4.6; 2 -3.175,-4.6; 3 -1.905,-4.6; 4 -0.635,-4.6; 5 0.635,-4.6; 6 1.905,-4.6; 7 3.175,-4.6; 8 4.445,-4.6; 9 4.445,4.6; 10 3.175,4.6; 11 1.905,4.6; 12 0.635,4.6; 13 -0.635,4.6; 14 -1.905,4.6; 15 -3.175,4.6; 16 -4.445,4.6
G5LE = drill 1.321 long: 1 -7.493,-5.969; 2 -7.493,5.969; O 4.699,5.969; P -9.525,0; S 4.699,-5.969
FTR-K1C = drill 1.3 pad 1.93: 1 -12.5,-3.75; 2 2.5,-3.75; 3 7.5,-3.75; 4 12.5,-3.75; 5 12.5,3.75; 6 7.5,3.75; 7 2.5,3.75; 8 -12.5,3.75
1206 = smd 1.6 x 1.803: A -1.422,0; C 1.422,0
CDRH4D28 = smd 2.5 x 5.3: P$1 -2.159,0; P$2 2.159,0
CHIPLED_1206 = smd 1.5 x 1.5: A 0,-1.75; C 0,1.75
SO-8 = smd 1.524 x 0.61: 1 -2.743,1.905; 2 -2.743,0.635; 3 -2.743,-0.635; 4 -2.743,-1.905; 5 2.743,-1.905; 6 2.743,-0.635; 7 2.743,0.635; 8 2.743,1.905
R0603 = smd 1 x 1.1: 1 -0.85,0; 2 0.85,0
R1206 = smd 1.6 x 1.803: 1 -1.422,0; 2 1.422,0
1X04 = drill 1.016 long: 1 -3.81,0; 2 -1.27,0; 3 1.27,0; 4 3.81,0
QFP50P900X900X160-48N = smd 1.473 x 0.279: 1 -4.216,2.743; 2 -4.216,2.261; 3 -4.216,1.753; 4 -4.216,1.245; 5 -4.216,0.762; 6 -4.216,0.254; 7 -4.216,-0.254; 8 -4.216,-0.762; 9 -4.216,-1.245; 10 -4.216,-1.753; 11 -4.216,-2.261; 12 -4.216,-2.743; 25 4.216,-2.743; 26 4.216,-2.261; 27 4.216,-1.753; 28 4.216,-1.245; 29 4.216,-0.762; 30 4.216,-0.254; 31 4.216,0.254; 32 4.216,0.762; 33 4.216,1.245; 34 4.216,1.753; 35 4.216,2.261; 36 4.216,2.743 | smd 0.279 x 1.473: 13 -2.743,-4.216; 14 -2.261,-4.216; 15 -1.753,-4.216; 16 -1.245,-4.216; 17 -0.762,-4.216; 18 -0.254,-4.216; 19 0.254,-4.216; 20 0.762,-4.216; 21 1.245,-4.216; 22 1.753,-4.216; 23 2.261,-4.216; 24 2.743,-4.216; 37 2.743,4.216; 38 2.261,4.216; 39 1.753,4.216; 40 1.245,4.216; 41 0.762,4.216; 42 0.254,4.216; 43 -0.254,4.216; 44 -0.762,4.216; 45 -1.245,4.216; 46 -1.753,4.216; 47 -2.261,4.216; 48 -2.743,4.216
OPI0 = drill 1 square: 1 0,0 | drill 1: 2 0,2.54; 3 2.54,0; 4 2.54,2.54; 5 5.08,0; 6 5.08,2.54; 7 7.62,0; 8 7.62,2.54; 9 10.16,0; 10 10.16,2.54; 11 12.7,0; 12 12.7,2.54; 13 15.24,0; 14 15.24,2.54; 15 17.78,0; 16 17.78,2.54; 17 20.32,0; 18 20.32,2.54; 19 22.86,0; 20 22.86,2.54; 21 25.4,0; 22 25.4,2.54; 23 27.94,0; 24 27.94,2.54; 25 30.48,0; 26 30.48,2.54 | hole 3: -5.815,1.694; 36.295,1.694; 36.295,41.805; -5.815,41.805
MKDSN1,5/2-5,08 = drill 1.3 pad 2: 1 -2.561,0.025; 2 2.519,0.025
MKDSN1,5/3-5,08 = drill 1.3 pad 2: 1 -7.641,0.025; 2 -2.561,0.025; 3 2.519,0.025

### Placement (x,y rotation side)
1W-1  13.32,60.52 0 top
1W-2  25.39,60.52 0 top
A0  44.75,33.21 270 bottom
A1  42.85,33.21 270 bottom
A2  40.95,33.21 270 bottom
C1  27.93,41.15 270 bottom
C2  30.78,41.15 90 top
C3  32.37,37.66 180 top
C4  18.4,56.07 90 bottom
C5  128.26,17.65 90 bottom
C6  14.91,50.36 90 top
C7  38.41,51.63 90 bottom
C8  18.72,22.1 270 top
C9  15.23,21.15 180 top
C10  22.85,17.65 0 top
C11  19.35,13.84 180 bottom
C12  28.88,15.75 90 top
C13  23.16,21.15 0 bottom
C14  15.86,37.6 180 top
C15  47.3,51.94 90 bottom
C16  59.99,16.7 90 bottom
C17  22.21,24.32 0 bottom
C18  30.15,24.32 0 top
C19  42.53,48.45 180 top
C20  6.34,56.07 90 bottom
C21  67.93,25.59 270 top
C22  15.23,12.26 180 top
C23  35.23,18.29 0 top
C24  42.85,55.44 0 top
C25  78.09,25.59 270 top
C26  88.25,25.59 270 top
C27  98.41,25.59 270 top
C32  38.09,42.1 270 top
C34  110.8,17.65 90 bottom
D1  74.6,26.54 90 bottom
D2  84.44,26.54 90 bottom
D3  78.41,15.11 180 top
D4  90.79,15.11 180 top
D5  64.12,16.38 270 bottom
D10  67.93,16.38 270 bottom
D14  42.85,52.26 0 top
D15  13.32,65.28 180 bottom
D16  25.39,65.28 180 bottom
D19  108.89,24.32 180 bottom
D21  124.13,24.64 180 bottom
DD1  42.53,46.86 90 bottom
FB1  33.01,41.15 90 top
I2C  2.85,37.97 270 top
IC1  21.9,49.4 270 top
IC2  42.85,52.58 0 bottom
IC3  123.18,17.65 180 bottom
IC4  16.18,22.73 270 bottom
IC5  14.28,56.07 0 bottom
IC6  22.21,21.46 0 top
IC7  42.53,44.64 180 top
IC8  26.34,56.07 0 bottom
IC9  45.07,34.16 0 top
IC10  105.72,17.65 180 bottom
K1  73.97,44.32 90 top
K2  110.48,41.15 90 top
K3  125.72,41.15 90 top
K6  93.02,44.32 90 top
L1W1  11.42,66.23 0 top
L1W2  23.48,66.23 0 top
L4.7  16.5,16.7 180 top
LED1  37.45,52.58 180 top
LED2  33.64,52.58 180 top
LED3  107.62,66.55 0 top
LED4  122.54,66.55 0 top
LED7  73.97,66.55 0 top
LED8  93.02,66.55 0 top
LED9  81.27,3.05 180 top
LED10  93.65,3.05 180 top
Q2  22.21,41.15 90 bottom
Q3  59.04,34.8 270 top
Q4  59.04,30.99 270 top
Q7  29.2,50.36 0 top
Q8  9.83,56.07 0 bottom
Q9  78.41,17.65 270 bottom
Q10  21.9,56.07 0 bottom
Q11  90.79,17.65 270 bottom
Q13  59.04,27.18 270 top
Q14  59.04,23.37 270 top
R1  15.23,30.35 180 top
R2  15.23,32.26 180 top
R3  15.23,30.35 0 bottom
R4  15.23,32.26 0 bottom
R5  15.23,41.15 180 top
R6  15.23,34.16 180 bottom
R7  15.23,36.07 180 bottom
R8  29.83,41.15 90 bottom
R9  121.27,17.34 180 top
R10  16.18,24.32 90 top
R11  14.28,24.32 90 top
R12  28.88,41.15 270 top
R13  26.98,41.15 90 top
R14  26.34,21.78 0 top
R15  121.27,19.24 180 top
R16  103.81,17.34 180 top
R17  103.81,19.24 180 top
R22  35.55,47.5 270 top
R23  33.64,47.5 270 top
R25  74.6,3.05 180 top
R26  71.74,25.91 90 bottom
R27  35.55,51.63 270 bottom
R28  26.02,41.15 270 bottom
R29  23.16,41.15 270 top
R30  25.06,41.15 270 top
R31  10.78,51.63 90 bottom
R32  22.85,51.63 90 bottom
R33  15.23,41.15 0 bottom
R34  15.23,39.24 0 bottom
R35  21.25,41.15 270 top
R36  80.31,66.55 0 top
R37  54.28,22.42 0 top
R38  8.88,51.63 90 bottom
R39  20.94,51.63 90 bottom
R40  54.28,35.75 180 top
R41  81.58,25.91 90 bottom
R42  99.36,66.55 0 top
R43  54.28,31.94 180 top
R44  54.28,18.61 180 top
R45  29.52,66.23 0 top
R47  54.28,16.7 180 top
R59  54.28,33.85 0 top
R60  54.28,30.04 0 top
R61  54.28,20.51 0 top
R62  54.28,14.8 0 top
R64  87.3,3.05 180 top
R70  15.23,43.05 0 top
R71  15.23,44.96 0 top
R72  15.23,27.81 180 top
R73  54.28,26.23 0 top
R74  101.91,25.91 90 bottom
R75  114.29,66.55 0 top
R76  17.45,66.23 0 top
R77  54.28,28.13 180 top
R82  91.43,25.91 90 bottom
R83  129.21,66.55 0 top
R84  54.28,24.32 180 top
SWD  38.72,12.57 0 top
U2  26.66,32.26 270 top
UART  2.85,27.81 270 top
UART2  2.85,17.65 90 top
X0  8.56,40.51 270 top
X1  110.48,60.2 0 top
X2  125.4,60.2 0 top
X4  120.64,8.76 180 top
X6  76.5,60.2 0 top
X8  95.55,60.2 0 top
X9  60.95,8.76 180 top
X10  78.41,8.76 180 top
X11  90.79,8.76 180 top
X15  103.17,8.76 180 top

### Tracks (layer width: path | path; a pad name or v marks a point on that pad's centre or on a via)
1W  (via drill 0.3)
  Top 0.305: IC1.2 20.63,50.04 20.94,50.36 20.94,52.9 | Q7.3 29.2,52.58 28.88,52.9 v25.39,52.9 20.94,52.9 | v13.32,52.9 20.94,52.9
  Bottom 0.305: IC5.3 v13.32,52.9 | IC8.3 v25.39,52.9
1W1-VDD
  Top 0.305: L1W1.A 10,60.59 1W-1.1
  Bottom 0.61: Q8.3 1W-1.1
1W2-VDD
  Top 0.305: L1W2.A 22.06,60.59 1W-2.1
  Bottom 0.61: Q10.3 1W-2.1
12V  (via drill 0.3, 0.5)
  Top 0.305: LED4.A v118.73,66.55 | LED3.A v103.49,66.55 | LED8.A v88.89,66.55 | LED7.A v69.84,66.55 | R12.1 28.88,46.86 v29.2,47.18
  Top 0.508: 23.17,20.19 23.16,20.19 23.23,20.19 IC6.3 23.16,18.74 C10.2 v26.02,17.65 | 28.55,17.65 28.88,17.99 C12.+
  Top 0.61: 28.55,17.65 v26.02,17.65
  Bottom 0.254: D10.C 68.04,18.29 | 33.33,46.23 32.69,46.86 29.51,46.86 v29.2,47.18
  Bottom 0.305: 33.33,46.23 34.91,44.64 44.75,44.64 47.3,47.18 C15.1
  Bottom 0.508: 64.06,18.12 D5.C | IC4.3 21.68,21.23 C13.2 21.76,13.96 C11.+ 24.12,13.84 26.02,15.75 v26.02,17.65
  Bottom 0.61: 68.04,18.29 69.84,18.29 71.74,20.19 R26.1 71.9,24.64 D1.C 76.19,24.64 77.14,25.59 79.05,25.59 80,24.64 81.43,24.64 R41.1 81.74,24.64 D2.C 86.35,24.64 87.3,25.59 89.2,25.59 90.16,24.64 91.28,24.64 R82.1 91.58,24.64 96.19,24.64 97.14,25.59 99.68,25.59 100.79,24.49 R74.1 106.82,24.49 D19.C 108.25,24.32 109.84,22.73 110.8,22.73 | 110.8,22.73 112.7,22.73 114.61,24.64 D21.C 123.5,24.64 125.4,22.73 127.3,22.73 128.26,21.78 128.26,20.25 | IC10.4 110.8,20.25 | 110.8,20.25 C34.2 | 110.8,20.25 110.8,22.73 | IC3.4 128.26,20.25 | 128.26,20.25 C5.2 | v118.73,66.55 v103.49,66.55 v88.89,66.55 v69.84,66.55 67.3,66.55 64.12,63.37 64.12,50.99 | 64.12,50.99 D5.C | IC2.1 46.9,50.6 C15.1 64.12,50.99 | v26.02,17.65 57.45,17.65 57.9,18.1 C16.2
  Bottom 1.016: D5.C D10.C | 64.06,18.12 60.02,18.12 C16.2
+3V3  (via drill 0.3, 0.5)
  Top 0.254: U2.24 21.69,29.52 21.26,29.08 v21.26,27.18 | U2.36 29.4,27.29 31,25.69 C18.2 31,22.73 30.47,22.73 | U2.48 32.89,35 v33.33,35.43 33.22,35.54 | 33.22,39.66 33.01,39.88 FB1.1 | 27.29,21.88 R14.2 27.19,22.63 27.29,22.73
  Top 0.406: v33.01,38.93 33.22,38.93
  Top 0.508: 33.22,39.66 33.22,38.93 C3.1 33.22,35.54 | SWD.1 34.91,14.16 36.75,16 C23.+ 36.75,20.26 34.28,22.73 30.47,22.73 27.29,22.73 v26.34,23.69
  Bottom 0.305: R8.2 30.89,42 31.1,41.78 31.1,39.88 32.06,38.93 v33.01,38.93
  Bottom 0.508: IC4.1 18.21,24.26 18.28,24.32 C17.2 21.26,24.42 21.26,25.91 | v33.33,35.43 32.37,34.48 32.37,30.35 30.15,28.13 26.34,28.13 24.12,25.91 | 21.26,25.91 v21.26,27.18 | v26.34,23.69 24.12,25.91 | 24.12,25.91 21.26,25.91
AD-3V3  (via drill 0.3)
  Top 0.254: U2.13 21.9,35 21.58,35.32 v21.58,36.07
  Bottom 0.254: R34.1 16.05,39.24 | R33.1 R34.1 | R34.1 18.4,36.92 18.4,35.11 19.04,34.48 20.94,34.48 21.58,35.11 v21.58,36.07
AD-5V0  (via drill 0.3)
  Top 0.254: R5.1 17.13,41.15 v17.45,40.83 | R35.2 21.25,38.93 v21.58,38.61 22.53,38.61 23.91,37.22 U2.12
  Bottom 0.254: v17.45,40.83 17.45,40.2 19.04,38.61 v21.58,38.61
AD-12V
  Top 0.254: R12.2 R13.1 26.97,39.56 26.66,39.24 26.02,39.24 24.9,38.12 U2.10
AD-BTT
  Top 0.254: 25.14,40.22 R30.2 | R29.2 R30.2 | U2.11 24.4,38.57 25.07,39.24 R30.2
ADR0  (via drill 0.3)
  Top 0.254: IC1.8 23.48,51.31 21.9,49.72 v21.9,44.64 | IC9.1 40.63,31.31 A2.2 v39.67,35.43
  Bottom 0.254: v21.9,44.64 22.85,43.69 23.8,43.69 25.07,44.96 26.34,44.96 26.97,44.32 31.42,44.32 39.67,36.07 v39.67,35.43 | A2.2
  other vias: 39.67,32.26
ADR1  (via drill 0.3)
  Top 0.254: IC1.7 23.17,50.04 22.53,49.4 22.53,45.59 v23.48,44.64 | IC9.2 41.9,31.94 A1.2 v41.58,35.43
  Bottom 0.254: v23.48,44.64 24.44,45.59 26.66,45.59 27.29,44.96 31.74,44.96 41.26,35.43 v41.58,35.43 | A1.2
  other vias: 41.58,32.26
ADR2  (via drill 0.3)
  Top 0.254: IC9.3 43.17,31.94 A0.2
  Bottom 0.254: A0.2
  other vias: 43.48,32.26
BAT+  (via drill 0.3)
  Top 0.254: X9.1 66.34,10.99 50.47,10.99 38.72,22.73 v38.72,23.37
  Top 0.305: R30.1 25.06,43.36 v25.7,44.01
  Bottom 0.254: v38.72,23.37 38.72,36.07 31.1,43.69 26.02,43.69 v25.7,44.01
  Bottom 1.016: D10.A 67.93,9.39 X9.1
DR-FD1  (via drill 0.3)
  Top 0.254: R9.2 v118.41,17.34 108.25,17.34 106.03,15.11 95.87,15.11 92.7,18.29 65.07,18.29 58.41,11.62 50.79,11.62 43.8,18.61 v43.8,19.24 | U2.32 27.42,26.99 v26.34,25.91
  Bottom 0.254: IC3.2 122.54,18.29 121.59,17.34 v118.41,17.34 | v26.34,25.91 26.34,25.27 32.06,19.56 43.49,19.56 v43.8,19.24
DR-FD2  (via drill 0.3)
  Top 0.254: R16.2 v100.95,17.34 95.55,17.34 93.33,19.56 64.44,19.56 57.77,12.89 51.42,12.89 46.03,18.29 46.03,19.88 35.4,30.51 U2.39
  Bottom 0.254: IC10.2 105.08,18.29 104.13,17.34 v100.95,17.34
DR-RS1  (via drill 0.3)
  Top 0.254: R15.2 v118.41,19.24 109.21,19.24 105.72,15.75 96.19,15.75 93.02,18.92 64.76,18.92 58.09,12.26 51.1,12.26 45.07,18.29 v45.07,18.92 | U2.33 27.9,26.2 v27.61,25.91
  Bottom 0.254: 121.27,19.56 120.95,19.24 v118.41,19.24 | v27.61,25.91 27.61,24.96 32.37,20.19 44.44,20.19 45.07,19.56 v45.07,18.92
  Bottom 0.305: IC3.1 121.27,19.56
DR-RS2  (via drill 0.3)
  Top 0.254: R17.2 v100.95,19.24 94.6,19.24 93.65,20.19 64.12,20.19 57.45,13.52 51.74,13.52 46.66,18.61 46.66,20.19 35.84,31.01 U2.40
  Bottom 0.254: 103.81,19.56 103.49,19.24 v100.95,19.24
  Bottom 0.305: IC10.1 103.81,19.56
EN_1W-1  (via drill 0.3)
  Top 0.305: IC9.11 v46.98,41.78
  Bottom 0.254: 15.76,45.8 15.96,45.59 23.48,45.59 24.12,46.23 26.97,46.23 27.61,45.59 32.06,45.59 34.28,43.37
  Bottom 0.305: R31.1 R38.1 | R31.1 11.52,50.78 12.05,51.31 12.05,55.43 12.69,56.07 14.91,56.07 15.23,56.39 IC5.6 | v46.98,41.78 44.75,41.78 43.17,43.37 34.28,43.37 | 15.76,45.8 R31.1
EN_1W-2  (via drill 0.3)
  Top 0.305: IC9.12 45.71,41.15 45.07,41.78 v45.07,43.05
  Bottom 0.254: R32.1 22.85,48.13 24.12,46.86 27.29,46.86 27.93,46.23 32.37,46.23 34.6,44.01
  Bottom 0.305: R39.1 R32.1 23.58,50.78 24.12,51.31 24.12,55.12 25.07,56.07 26.97,56.07 27.29,56.39 IC8.6 | v45.07,43.05 44.12,44.01 34.6,44.01
FET
  Top 0.305: R25.2 73.75,6.6 X10.2
  Top 0.61: D3.A 76.51,9.36 X10.2
  Bottom 0.61: Q9.8 76.5,12.89 | Q9.7 77.77,13.21 78.09,12.89 | Q9.6 79.05,13.21 78.73,12.89 | Q9.5 80.31,13.21 80,12.89
  Bottom 1.27: X10.2 75.89,12.28 76.5,12.89 78.09,12.89 78.73,12.89 80,12.89
FET1
  Top 0.305: R64.2 86.45,6.91 X11.2
  Top 0.61: D4.A 88.89,9.36 X11.2
  Bottom 0.61: Q11.8 88.89,13.21 89.2,12.89 | Q11.7 90.16,13.21 89.84,12.89 | Q11.6 91.43,13.21 91.11,12.89 | Q11.5 92.7,13.21 92.38,12.89
  Bottom 1.27: X11.2 88.27,12.28 88.89,12.89 89.2,12.89 89.84,12.89 91.11,12.89 92.38,12.89
FR1
  Bottom 0.61: IC3.5 125.08,13.21 124.77,12.89 | IC3.6 123.81,13.21 124.13,12.89
  Bottom 1.27: X4.1 128.28,9.69 125.08,12.89 124.77,12.89 124.13,12.89
FR2
  Bottom 0.61: IC10.5 107.62,12.89 | IC10.6 106.35,13.21 106.67,12.89
  Bottom 1.27: X15.1 110.82,9.69 107.62,12.89 106.67,12.89
GND  (via drill 0.3)
  Top 0.254: R29.1 | U2.8 25.9,35.24 | U2.47 29.55,34.52 | U2.35 28.92,26.9 | 23.68,30 U2.23 20.94,30
  Top 0.508: IC6.1 21.26,17.84 C10.1
  Bottom 0.508: I2C.3 3.8,34.48 v5.07,34.48 | 5.07,26.38 4.91,26.54 4.12,26.54 UART.3 UART2.3
  other vias: 6.34,44.32 12.85,40.67 26.02,13.21 31.74,13.21 6.34,13.84 16.5,18.92 16.5,16.38 18.09,11.3 26.02,19.24 20.15,22.26 12.69,23.37 5.07,31.31 5.07,37.02 5.07,39.56 5.07,26.54 24.12,23.05 28.88,26.54 20.15,20.19 22.85,16.07 13.01,29.08 28.88,34.8 24.75,30.67 51.42,15.75 51.42,19.56 51.42,37.97 39.04,39.56 26.98,47.82 20.94,48.13 16.81,48.13 20.31,44.32 57.14,15.11 57.14,20.19 61.58,12.57 23.48,38.93 32.05,48.13 26.98,50.67 32.37,52.58 36.82,49.09 45.71,48.77 28.56,30.67 33.01,28.77 33.01,24.32 60.31,25.27 60.31,29.08 60.31,32.89 60.31,36.7 60.31,21.46 71.74,12.57 84.44,12.57 95.87,12.57 112.38,12.57 117.46,12.57 128.89,12.57 128.89,24 120,22.1 102.22,22.1 36.18,34.16 45.71,34.16 37.45,30.99 42.53,26.54 51.42,22.73 51.42,25.91 51.42,29.72 51.42,34.16 19.67,29.08 33.01,21.46 42.53,21.46 30.47,53.21 15.86,53.85 27.93,53.85 21.9,53.85 18.09,53.85 7.92,57.02 39.99,57.02 46.34,57.02 34.59,57.02 52.38,57.02 6.97,67.18 33.64,67.18 5.7,58.93 5.7,51.94 44.44,40.83 22.53,28.13 58.09,57.02
  pour Bottom: 4.75,0.83 4.75,68.14 63.17,68.14 63.17,0.83
  pour Top: 4.75,0.83 4.75,68.14 63.17,68.14 63.17,0.83
  pour Top: 62.85,27.81 130.16,27.81 130.16,1.14 62.85,1.14
  pour Bottom: 62.85,27.81 130.16,27.81 130.16,1.14 62.85,1.14
GPIO1
  Top 0.305: IC9.9 49.52,37.02 50.79,35.75 R40.2 R59.1
GPIO2
  Top 0.305: IC9.10 48.25,35.75 52.06,31.94 R43.2 R60.1
GPIO4
  Top 0.305: IC9.7 48.25,28.13 48.88,27.5 51.42,27.5 52.06,28.13 R77.2 R73.1
GREEN
  Top 0.254: U2.46 33.17,34.01 34.28,35.11 34.28,39.56 34.91,40.2 34.91,44.32 33.64,45.59 R23.2
IN12V
  Top 0.305: LED9.A 82.69,7.02 X10.1 | LED10.A 95.07,7.02 X11.1
  Top 0.61: D3.C 80.31,9.4 X10.1 | D4.C 92.69,9.4 X11.1
  Bottom 1.016: D5.A 64.12,9.35 X9.2
  Bottom 1.27: X9.2 63.51,7.47 64.76,6.22 80.63,6.22 | 80.63,6.22 90.84,6.22 X11.1 | X10.1 80.97,6.56 80.63,6.22
INTR
  Top 0.254: X0.12 R72.2 14.38,28.55 14.91,29.08 16.81,29.08 17.45,28.45 17.45,26.86 18.72,25.59 23.8,25.59 24.9,26.7 U2.27
IO13
  Top 0.305: IC9.5 45.71,26.86 52.06,20.51 R61.1 R44.2
N$2
  Bottom 3.048: K3.5 K3.4 129.47,58.67 X2.2
N$3
  Top 0.508: IC6.2 22.21,20.7 21.7,21.21 18.72,21.21 C8.2
  Top 1.016: L4.7.P$1 18.72,16.95 C8.2
N$4
  Bottom 0.254: Q2.3 24.16,42 R28.1
N$5  (via drill 0.3)
  Top 0.254: R71.2 17.13,44.96 v17.45,44.64
  Bottom 0.254: v17.45,44.64 18.4,43.69 18.4,41.78 19.99,40.2 Q2.1
N$9
  Top 0.305: IC9.6 46.98,27.81 50.47,24.32 R84.2 R37.1
N$10  (via drill 0.3)
  Top 0.254: R44.1 60.63,18.61 63.49,21.46 81.9,21.46 v82.54,22.1
  Bottom 0.254: Q9.4 80.31,21.46 80.95,22.1 v82.54,22.1
N$11
  Top 0.305: IC1.6 28.08,48.77 Q7.1
N$13
  Top 0.305: Q14.1 R84.1
N$15
  Top 0.305: Q3.3 64.12,34.8 68.25,30.67 76.5,30.67 80,34.16 80,36.77 | R36.2 83.49,64.22 83.49,40.39 K1.1
  Top 0.406: 80,36.77 K1.1
  Bottom 0.305: 74.6,28.77 80,34.16 80,36.77
  Bottom 0.406: D1.A 74.6,28.77 | 80,36.77 K1.1
N$16
  Bottom 0.305: K1.2 68,27.43 | R26.2 67.97,27.33 C21.+
  Bottom 0.406: 68,27.43 C21.+
N$17
  Top 0.254: IC6.6 | 18.72,23.37 C8.1
  Top 0.508: IC6.6 21.26,23.37 18.72,23.37
N$18
  Top 0.305: LED7.C R36.1
N$19
  Top 0.305: Q3.1 R40.1
N$20
  Top 0.305: 99.05,36.77 99.05,34.16 94.92,30.04 63.81,30.04 62.85,30.99 Q4.3 | R42.2 102.54,64.22 102.54,40.39 K6.1
  Top 0.406: 99.05,36.77 K6.1
  Bottom 0.305: D2.A 85.71,28.44 87.62,30.35 95.24,30.35 99.05,34.16 99.05,36.77
  Bottom 0.406: 99.05,36.77 K6.1
N$21
  Bottom 0.305: C25.+ 78.13,27.33 R41.2 81.58,31.37 K6.2
N$22
  Top 0.254: 23.17,22.73 IC6.4 23.17,23.37 22.21,24.32 17.77,24.32 16.92,25.17 R10.2 R11.2
N$23
  Top 0.305: LED8.C R42.1
N$24
  Top 0.305: Q4.1 R43.1
N$27
  Bottom 0.61: IC5.4 1W-1.2 D15.3
N$37
  Bottom 0.305: Q8.1 R31.2
N$39
  Top 0.305: IC9.4 44.44,24.32 52.06,16.7 R47.2 R62.1
N$40
  Top 3.048: K3.3 125.72,48.65 | 125.72,48.65 K3.6 | X2.1 122.84,58.63 125.72,55.75 125.72,48.65
N$41
  Bottom 0.61: IC8.4 1W-2.2 D16.3
N$45
  Bottom 0.305: Q10.1 R32.2
N$47
  Top 2.54: K1.P 73.94,34.82 X6.2
N$51
  Top 2.54: K6.P 93.02,60.2 X8.2
N$55
  Top 0.305: R75.2 117.46,64.22 117.46,31.88 K2.1 111.89,30.99 105.08,30.99 103.49,29.4 63.81,29.4 61.58,27.18 Q13.3
  Bottom 0.305: D19.A 112.38,24.32 114.29,26.23 114.29,28.59 K2.1
N$60
  Bottom 0.305: C27.+ 101.87,27.37 R74.2 103.22,28.65 K2.8
N$62
  Top 0.305: LED3.C R75.1
N$69  (via drill 0.3)
  Top 0.254: R47.1 59.68,16.7 63.81,20.83 93.65,20.83 v94.28,21.46
  Bottom 0.254: Q11.4 92.7,21.15 93.02,21.46 v94.28,21.46
N$70
  Top 0.305: R64.1 LED10.C
N$71
  Top 0.305: R25.1 LED9.C
N$75
  Top 0.254: R22.1 35.55,50.04 36.34,50.83 LED1.C
N$111
  Top 0.305: 60.31,23.37 Q14.3 61.58,23.37 66.98,28.77 103.81,28.77 105.4,30.35 109.84,30.35 113.33,26.86 127.68,26.86 K3.1 132.7,31.88 132.7,60.52 131.43,61.79 131.43,65.18 R83.2
  Bottom 0.305: D21.A 127.94,24.64 129.53,26.23 129.53,28.59 K3.1
N$112
  Top 0.305: Q13.1 R77.1
N$115
  Top 0.305: L1W2.C R45.1
N$116
  Top 0.305: L1W1.C R76.1
N$117
  Bottom 0.305: C26.+ 91.39,27.37 R82.2 95.07,27.33 98.1,30.35 120.26,30.35 K3.8
N$118
  Top 0.305: LED4.C R83.1
N$119
  Top 0.254: LED2.C R23.1
N$128
  Top 2.54: X1.1 107.94,60.2
  Top 3.048: K2.3 110.48,48.65 | 110.48,48.65 K2.6 | 107.94,60.2 107.94,58.29 110.48,55.75 110.48,48.65
N$129
  Bottom 3.048: K2.5 K2.4 114.23,58.99 X1.2
NC1
  Top 2.54: K1.O 68,59.35 X6.1
NC6
  Top 2.54: K6.O 87.05,59.35 X8.1
NO1
  Top 2.54: K1.S 79.93,59.31 X6.3
NO6
  Top 2.54: K6.S 98.98,59.31 X8.3
PA06
  Top 0.254: R71.1 R70.1 12.37,43.05 11.73,42.42 10.46,42.42 9.83,41.78 9.83,39.88 9.2,39.24 7.92,39.24 7.29,38.61 7.29,33.53 7.92,32.89 X0.7
PWR-EN
  Top 0.254: IC6.5 22.28,22.61 22.28,22.04 22.53,21.78 R14.1 25.41,21.78 U2.28
RED
  Top 0.254: U2.45 33.62,33.5 34.91,34.8 34.91,39.24 35.55,39.88 R22.2
RESET  (via drill 0.3)
  Top 0.254: U2.7 26.4,37.72 26.66,37.97 27.61,37.97 v27.93,38.29
  Bottom 0.254: R8.1 C1.2 | v27.93,38.29 C1.2 | C1.2 R28.2
RS1
  Bottom 0.61: IC3.8 121.27,12.89 | IC3.7 122.54,13.21 122.22,12.89
  Bottom 1.27: X4.3 118.12,9.74 121.27,12.89 122.22,12.89
RS2
  Bottom 0.61: IC10.8 103.81,12.89 | IC10.7 105.08,13.21 104.76,12.89
  Bottom 1.27: X15.3 100.66,9.74 103.81,12.89 104.76,12.89
RX  (via drill 0.3)
  Top 0.254: U2.31 26.91,31.69 v25.7,32.89 | R2.1 17.13,32.26 v17.45,32.58
  Bottom 0.254: v25.7,32.89 25.39,32.58 v17.45,32.58
SCL  (via drill 0.3)
  Top 0.254: v26.97,33.53 28.5,32 U2.42 37.83,32 38.41,32.58 38.41,35.75 39.04,36.39 42.21,36.39 43.17,37.34 IC9.14 43.17,41.47 43.49,41.78 IC7.5 | v12.62,33.84 v17.45,33.84 18.4,33.84 19.67,35.11 19.67,37.97 19.35,38.29 19.35,47.5 IC1.4
  Bottom 0.254: I2C.2 5.39,35.43 X0.5 9.2,35.43 10.46,34.16 12.31,34.16 v12.62,33.84 12.94,34.16 R6.1 | v26.97,33.53 26.66,33.84 25.39,33.84 24.75,33.21 18.08,33.21 v17.45,33.84
SDA  (via drill 0.3)
  Top 0.254: v13.2,34.99 13.32,35.11 v17.45,35.11 | IC7.4 41.58,41.78 41.9,41.47 IC9.15 41.9,37.65 41.26,37.02 38.72,37.02 37.77,36.07 37.77,32.89 37.39,32.51 U2.43 28.94,32.51 27.93,33.53 v27.93,34.16 27.61,34.48 26.34,34.48 26.02,34.16 24.75,34.16 19.99,38.93 19.99,42.73 20.31,43.05 23.48,43.05 24.44,44.01 24.44,47.5 IC1.5
  Bottom 0.254: X0.3 9.83,36.7 11.54,36.7 12.18,36.07 13.07,36.07 | 8.5,37.97 X0.3 | R7.1 13.07,36.07 | v13.2,34.99 13.2,35.94 13.07,36.07 | I2C.1 5.39,37.97 X0.3 | v27.93,34.16 27.61,34.48 25.07,34.48 24.44,33.84 18.72,33.84 v17.45,35.11
SWCKL
  Top 0.254: U2.37 31.31,29.52 31.42,29.4 31.42,28.45 39.99,19.88 SWD.3
SWDIO
  Top 0.254: U2.34 28.41,29.25 28.56,29.4 29.51,29.4 38.72,20.19 38.72,14.48 37.45,13.21 SWD.2
TX  (via drill 0.3)
  Top 0.254: U2.30 26.4,31.24 26.02,31.62 v25.7,31.62 | R1.1 v17.45,30.35
  Bottom 0.254: v17.45,30.35 17.45,30.99 18.4,31.94 25.39,31.94 v25.7,31.62
VDD  (via drill 0.5)
  Top 0.305: 31.42,54.33 31.42,49.4 30.95,48.94 30.47,48.94 Q7.2
  Top 0.61: C24.1 40.82,54.26 40.82,54.16 | 40.82,54.16 D14.C 40.82,50.23 39.67,49.09 v38.41,49.09 | 40.82,54.16 40.66,54.33 LED1.A LED2.A 31.42,54.33 30.63,55.12 19.67,55.12 | 19.67,54.33 v19.67,53.85 19.67,55.12 | v7.61,53.85 8.88,55.12 19.67,55.12
  Bottom 0.305: 7.61,54.97 Q8.2 R38.2 | 7.61,54.97 6.59,54.97 C20.1 | R39.2 Q10.2 19.5,54.97 | 18.65,54.97 C4.1 18.4,54.97 18.65,54.97 | v7.61,53.85 7.61,54.97 | IC2.3 41.35,47.89 DD1.2 | 18.65,54.97 19.5,54.97 | 19.5,54.97 19.67,54.8
  Bottom 0.61: IC2.3 38.48,50.6 C7.1 | C7.1 35.65,50.68 R27.2 | C7.1 v38.41,49.09 | D15.2 14.27,67.5 14.59,67.82 19.67,67.82 | 19.67,67.82 19.67,54.8 v19.67,53.85 | D16.2 26.34,67.5 26.02,67.82 19.67,67.82
VDD_OK  (via drill 0.3)
  Top 0.254: U2.2 28.92,38.01 v29.2,38.29 | v35.86,37.34 35.86,39.24 36.18,39.56 36.18,44.96 v36.82,45.59
  Bottom 0.254: v29.2,38.29 31.74,38.29 32.06,37.97 35.23,37.97 v35.86,37.34 | DD1.1 37.14,45.91 v36.82,45.59
VDDA
  Top 0.254: FB1.2 33.01,41.78 32.06,41.78 31.74,41.47 31.74,40.51 31.52,40.3 C2.1 30.78,39.24 30.15,39.24 | U2.9 25.41,37.68 26.34,38.61 26.97,38.61 27.61,39.24 30.15,39.24 | U2.1 29.4,37.22 30.15,37.97 30.15,39.24
Z2RX
  Bottom 0.254: X0.11 5.39,24.64 5.39,18.61 4.43,17.65 UART2.2
Z2TX
  Bottom 0.254: X0.13 6.97,25.27 6.02,24.32 6.02,18.29 UART2.1
Z3V3  (via drill 0.3, 0.5)
  Top 0.254: R72.1 16.18,27.71 v16.18,26.54
  Top 0.305: 43.48,48.35 C19.1 | C6.2
  Top 0.406: 43.48,48.35 IC7.1 43.48,44.96 43.17,44.64 39.99,44.64 | IC9.16 40.63,40.52 v39.99,41.15 | IC1.1 v16.81,51.31 C6.2 | C6.2 13.64,51.3 13.01,50.67 13.01,44.96 11.42,43.37 10.15,43.37 8.56,41.78 X0.1 | v16.81,58.29 v28.88,58.29 | 39.99,44.64 39.99,46.86 v39.36,47.5 | C32.2 v39.99,41.15 | 39.99,44.64 v39.99,41.15
  Bottom 0.254: A0.1 42.53,34.06 | 42.53,34.06 42.53,36.39 39.99,38.93 v39.99,41.15 | A2.1 A1.1 42.53,34.06
  Bottom 0.406: IC5.5 14.28,58.29 14.91,58.93 16.18,58.93 v16.81,58.29 v16.81,51.31 | IC8.5 26.34,58.29 26.97,58.93 28.24,58.93 v28.88,58.29 28.88,53.21 34.6,47.5 v39.36,47.5
  Bottom 0.508: 16.05,29.08 16.05,31.62 R4.1 16.05,31.75 16.05,34.16 R6.2 16.05,34.29 16.05,36.7 R7.2 16.05,36.83 14.4,38.48 14.4,39.24 R34.2 | 16.05,29.08 R3.1 | X0.17 8.56,20.83 9.83,22.1 9.83,23.37 10.46,24 11.99,24 14.53,26.54 16.05,26.54 | X0.1 9.2,40.51 10.46,39.24 R34.2 | 16.05,29.08 16.05,26.54 | 14.28,39.34 R34.2 | v16.18,26.54 16.05,26.54
Z5V
  Top 0.508: X0.2 X0.4 | 14.28,37.97 14.28,41.15 R5.2 | 14.28,37.97 C14.+ 14.15,37.85 | X0.4 9.83,36.7 9.83,22.1 10.46,21.46 12.56,21.46 12.87,21.15 C9.2 R11.1 | 14.28,37.97 X0.4
  Top 1.016: C9.2 14.28,16.7 | C22.2 14.28,16.7 | 14.28,16.7 L4.7.P$2
ZRX
  Top 0.254: 14.4,30.35 R3.2 X0.10
  Bottom 0.254: UART.2 4.12,29.08 9.83,29.08 X0.10 R3.2
ZTX
  Top 0.254: R4.2 11.73,32.26 X0.8
  Bottom 0.254: R4.2 11.73,32.26 X0.8 10.46,32.89 9.2,34.16 6.66,34.16 UART.1

### Text on the board
Top: TOP
Bottom: BOTTOM
tNames: NC NO | NC NO | + | SDA | SCL | GND | RX | TX | GR | GR | RX | TX | + D C G | - PS A | R G F | R G F
bNames: VCC | SWDIO | SWCLK | GND